# EAGLE design MultiCoupler (EAGLE 7.1.0)
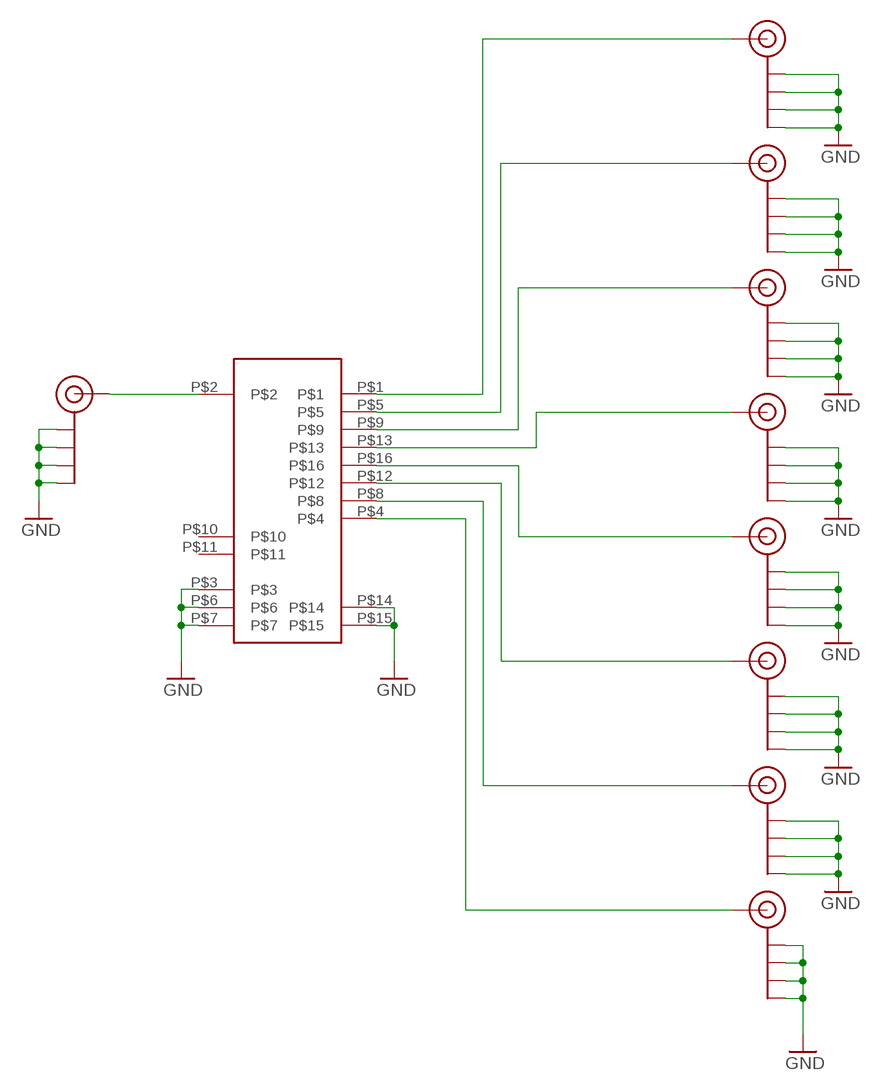
[diagram p0: schematic, sheet 1]

## Parts
J$1  SMA_EDGE  [SMA-EDGE]
J$2  SMA_EDGE  [SMA-EDGE]
J$3  SMA_EDGE  [SMA-EDGE]
J$4  SMA_EDGE  [SMA-EDGE]
J$5  SMA_EDGE  [SMA-EDGE]
J$6  SMA_EDGE  [SMA-EDGE]
J$7  SMA_EDGE  [SMA-EDGE]
J$8  SMA_EDGE  [SMA-EDGE]
J$9  SMA_EDGE  [SMA-EDGE]
U$1  PSC-8-1-75THROUGH_HOLE  [PSC-8-1-75]

## Nets
GND: J$1.GND@0(GND) J$1.GND@1(GND) J$1.GND@2(GND) J$1.GND@3(GND) J$2.GND@0(GND) J$2.GND@1(GND) J$2.GND@2(GND) J$2.GND@3(GND) J$3.GND@0(GND) J$3.GND@1(GND) J$3.GND@2(GND) J$3.GND@3(GND) J$4.GND@0(GND) J$4.GND@1(GND) J$4.GND@2(GND) J$4.GND@3(GND) J$5.GND@0(GND) J$5.GND@1(GND) J$5.GND@2(GND) J$5.GND@3(GND) J$6.GND@0(GND) J$6.GND@1(GND) J$6.GND@2(GND) J$6.GND@3(GND) J$7.GND@0(GND) J$7.GND@1(GND) J$7.GND@2(GND) J$7.GND@3(GND) J$8.GND@0(GND) J$8.GND@1(GND) J$8.GND@2(GND) J$8.GND@3(GND) J$9.GND@0(GND) J$9.GND@1(GND) J$9.GND@2(GND) J$9.GND@3(GND) U$1.P$3 U$1.P$6 U$1.P$7 U$1.P$14 U$1.P$15
N$1: J$1.SIG(SIGNAL) U$1.P$2
N$2: J$9.SIG(SIGNAL) U$1.P$1
N$3: J$8.SIG(SIGNAL) U$1.P$5
N$4: J$7.SIG(SIGNAL) U$1.P$9
N$5: J$2.SIG(SIGNAL) U$1.P$13
N$6: J$3.SIG(SIGNAL) U$1.P$16
N$7: J$4.SIG(SIGNAL) U$1.P$12
N$8: J$5.SIG(SIGNAL) U$1.P$8
N$9: J$6.SIG(SIGNAL) U$1.P$4
Unconnected: U$1.P$10 U$1.P$11

## Library data of the parts
J$1-J$9 = SparkFun-Connectors:SMA_EDGE: SMA Antenna Connector End launch SMA connector. The paste layer has been removed so that the connector can be hand soldered onto the board after reflow.
U$1 = minicir-dt:PSC-8-1-75

## Board
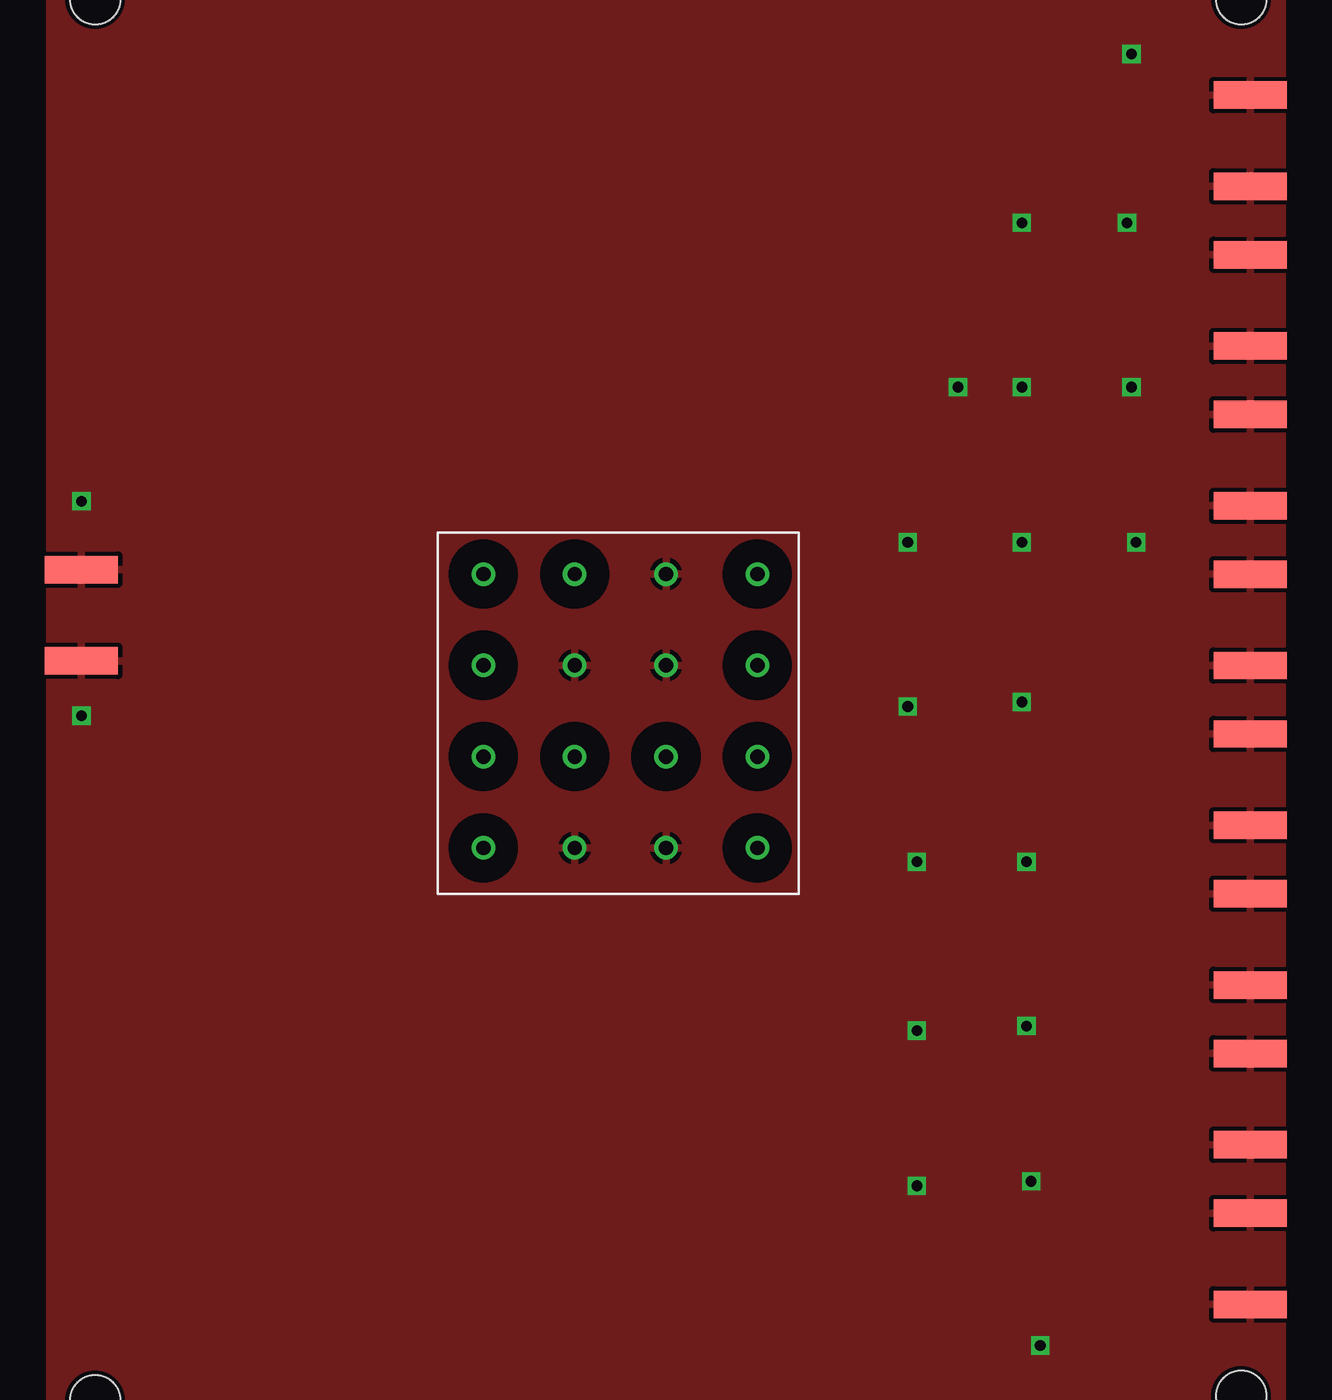
[diagram p1: board, top side]
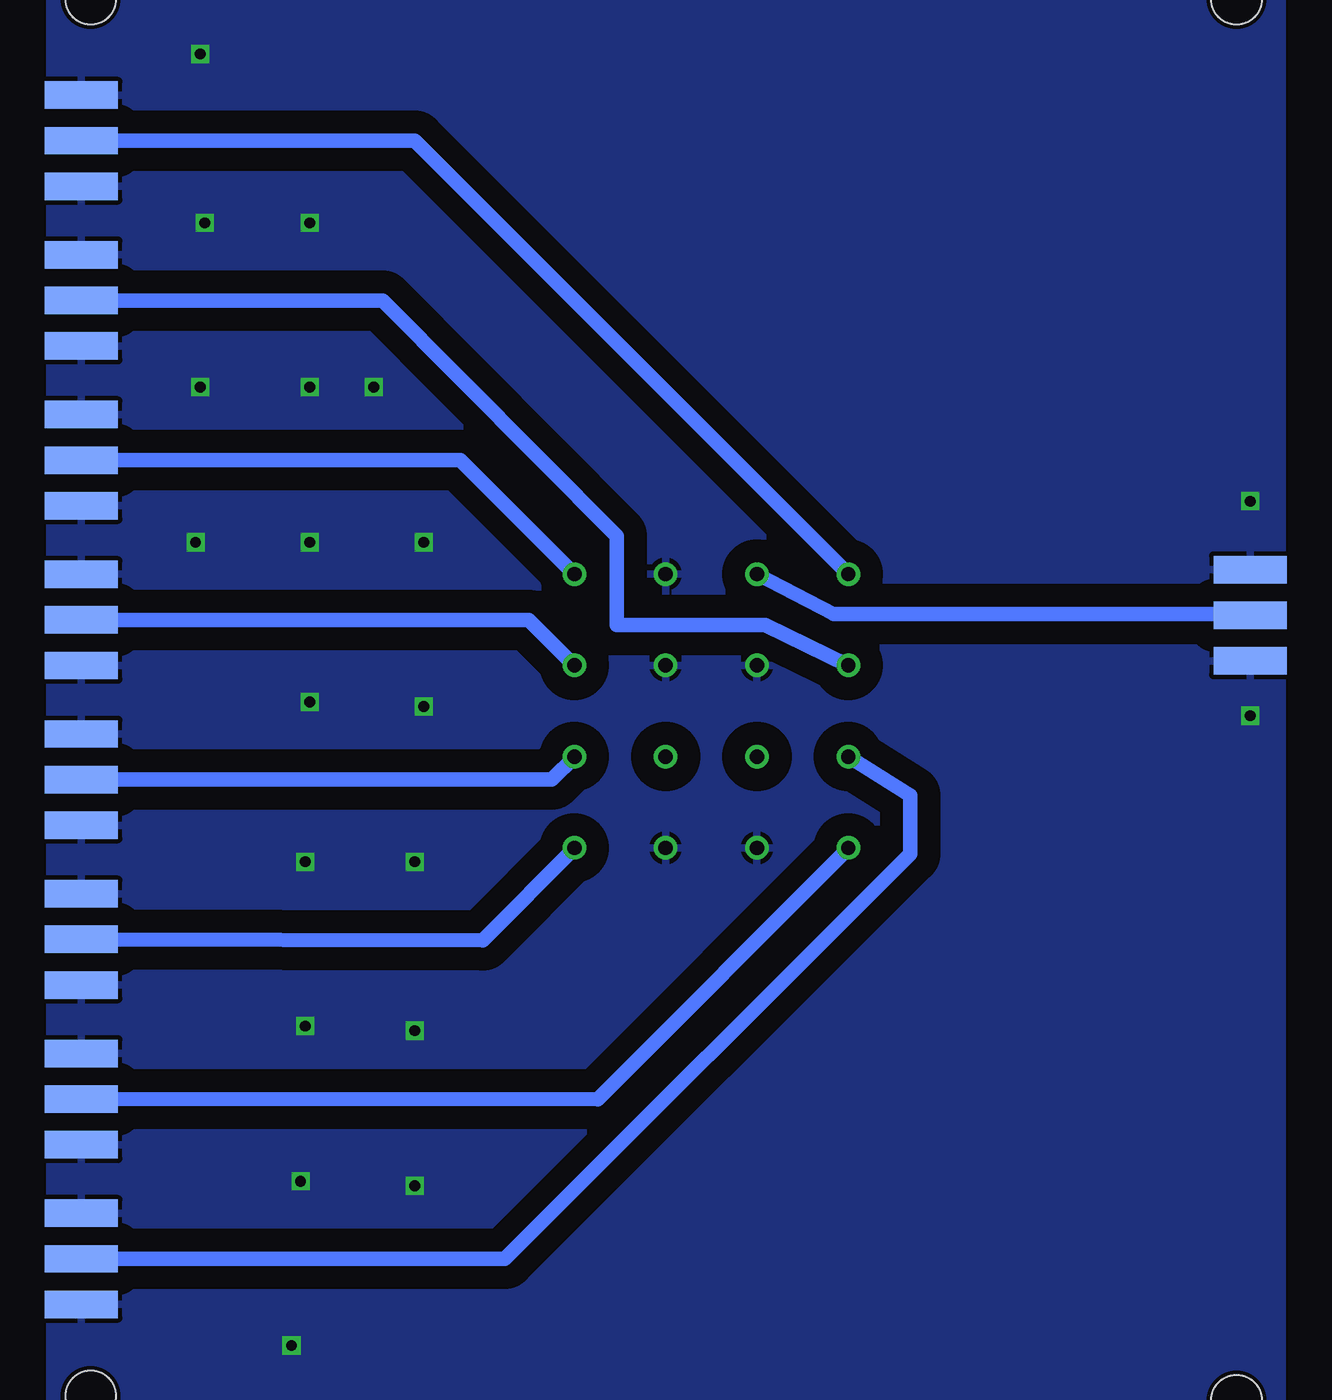
[diagram p2: board, bottom side, seen from below]

No outline drawn. Coordinates in mm, seen from the top.
Copper layers (1*16): Top 0.035mm / dielectric 1.5mm / Bottom 0.035mm
Design rules "default *": minimum track width 20mil, minimum drill 24mil, track to track 50mil, track to pad 40mil, pad to pad 40mil, via to via 8mil, smd to smd 8mil, copper to edge 10mil, drill to drill 8mil, minimum pad ring 10mil, minimum via ring 8mil, stop-mask expansion 4mil, vias tented up to drill 0mil, thermal gap 10mil
Holes 2.8 mm at 2.54,80.26 66.29,80.26 66.29,2.54 2.54,2.29

### Footprints (pad centres in the part's own frame; a part is rotated, then mirrored left to right if it is on the bottom)
SMA-EDGE = smd 1.524 x 4.064: GND@0 0,0; GND@1 5.08,0; SIG 2.54,0 | smd 1.524 x 4.064 bottom: GND@2 0,0; GND@3 5.08,0
PSC-8-1-75 = drill 0.8: P$1 2.55,17.79; P$2 7.63,17.79; P$3 12.71,17.79; P$4 17.79,17.79; P$5 2.55,12.71; P$6 7.63,12.71; P$7 12.71,12.71; P$8 17.79,12.71; P$9 2.55,7.63; P$10 7.63,7.63; P$11 12.71,7.63; P$12 17.79,7.63; P$13 2.55,2.55; P$14 7.63,2.55; P$15 12.71,2.55; P$16 17.79,2.55

### Placement (x,y rotation side)
J$1  1.78,43.43 90 bottom
J$2  66.8,16.51 90 bottom
J$3  66.8,25.4 90 bottom
J$4  66.8,34.29 90 bottom
J$5  66.8,43.18 90 bottom
J$6  66.8,52.07 90 bottom
J$7  66.8,7.62 90 bottom
J$8  66.8,60.96 90 bottom
J$9  66.8,69.85 90 bottom
U$1  21.59,30.48 0 top

### Tracks (layer width: path | path; a pad name or v marks a point on that pad's centre or on a via)
GND  (via drill 0.6)
  other vias: 1.78,52.32 1.78,40.39 55.12,5.33 54.61,14.48 48.26,14.22 48.26,22.86 54.36,23.11 54.36,32.26 48.26,32.26 47.75,40.89 54.1,41.15 47.75,50.04 54.1,50.04 60.45,50.04 60.2,58.67 54.1,58.67 50.55,58.67 54.1,67.82 59.94,67.82 60.2,77.22
  pour Bottom: 0,0 0,82.8 68.58,82.8 68.58,0
  pour Top: 0,0 0,82.8 68.58,82.8 68.58,0
N$1
  Bottom 0.508: 0.64,46.04 1.14,45.97 2.67,46.23 J$1.SIG
  Bottom 0.813: U$1.P$2 24.96,46.04 0.64,46.04
N$2
  Bottom 0.813: U$1.P$1 48.26,72.39 J$9.SIG
N$3
  Bottom 0.813: U$1.P$5 28.75,45.44 37.01,45.44 37.01,50.39 50.04,63.5 J$8.SIG
N$4
  Bottom 0.813: U$1.P$9 20.7,35.94 20.7,32.7 43.24,10.16 J$7.SIG
N$5
  Bottom 0.508: 24.07,33.07 U$1.P$13
  Bottom 0.813: 24.07,33.07 38.09,19.02 J$2.SIG
N$6
  Bottom 0.508: 39.33,33.05 U$1.P$16
  Bottom 0.813: 39.33,33.05 44.49,27.89 J$3.SIG
N$7
  Bottom 0.508: 39.36,38.1 U$1.P$12
  Bottom 0.813: 39.36,38.1 40.63,36.83 J$4.SIG
N$8
  Bottom 0.813: U$1.P$8 41.91,45.72 J$5.SIG
N$9
  Bottom 0.813: U$1.P$4 45.72,54.61 J$6.SIG